# EAGLE schematic board schema (EAGLE 8.1.0)
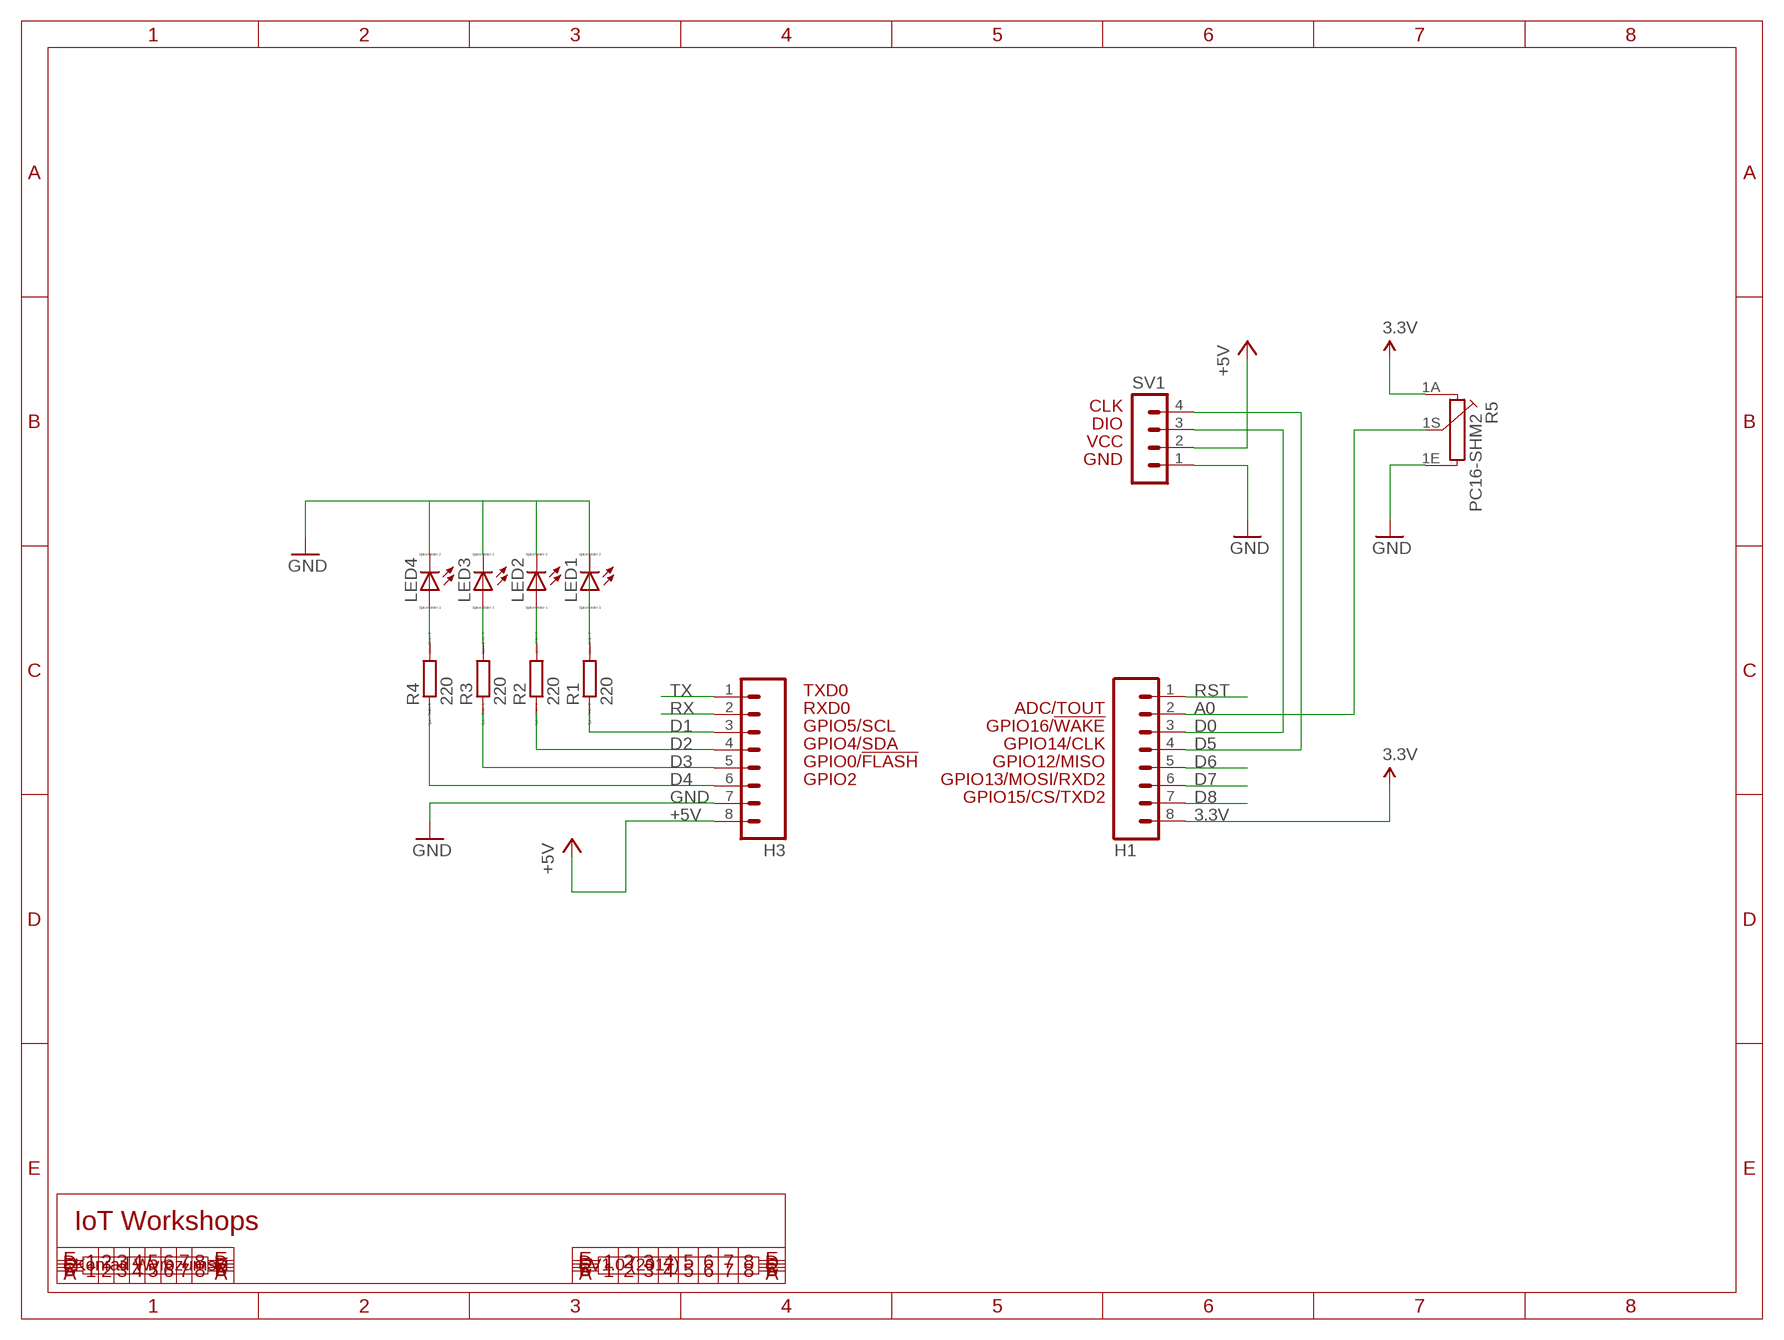
[diagram p0: schematic, sheet 1]

## Parts
H1  M08  [1X08]
H3  M08  [1X08]
LED1  LED_ELD260  [LED_LD260]
LED2  LED_ELD260  [LED_LD260]
LED3  LED_ELD260  [LED_LD260]
LED4  LED_ELD260  [LED_LD260]
R1  220  R0207/10  [0207/10]
R2  220  R0207/10  [0207/10]
R3  220  R0207/10  [0207/10]
R4  220  R0207/10  [0207/10]
R5  PC16-SHM2  [PC16-SHM2]
SV1  MA04-1  [MA04-1]

## Nets
3.3V: H1.8 R5.1A
+5V: H3.8 SV1.2
A0: H1.2 R5.1S
D0: H1.3 SV1.3
D1: H3.3 R1.1
D2: H3.4 R2.1
D3: H3.5 R3.1
D4: H3.6 R4.1
D5: H1.4 SV1.4
D6: H1.5
D7: H1.6
D8: H1.7
GND: H3.7 LED2.K(C) LED3.K(C) LED4.K(C) R5.1E SV1.1
N$1: LED4.A R4.2
N$2: LED3.A R3.2
N$3: LED2.A R2.2
N$4: LED1.A LED1.K(C) R1.2
RST: H1.1
RX: H3.2
TX: H3.1
Unconnected: R5.M1 R5.M2 R5.M3 R5.M4

## Notes on the sheet
- CLK
- DIO
- VCC
- GND
- TXD0
- RXD0 | ADC/TOUT
- GPIO5/SCL | GPIO16/!WAKE
- GPIO4/SDA | GPIO14/CLK
- GPIO0/!FLASH | GPIO12/MISO
- GPIO2 | GPIO13/MOSI/RXD2
- GPIO15/CS/TXD2
- IoT Workshops
- Konrad Wyrozumski | V1.0 (2017)

## Library data of the parts
H1 H3 = freetronics-original:M08: Header 8 Standard 8-pin 0.1" header. Use with straight break away headers (SKU : PRT-00116), right angle break away headers (PRT-00553), swiss pins (PRT-00743), machine pins (PRT-00117), and female headers (PRT-00115).
LED1-LED4 = eagle-ltspice:LED_E: LED Source: http://www.osram.convergy.de Source: www.luxeon.com Source: www.kingbright.com; SPICEMODEL: NONE; SPICEPREFIX: D; SPICETYPE: diode
R1-R4 = eagle-ltspice:R: RESISTOR, European symbol; SPICEMODEL: NONE; SPICEPREFIX: R
R5 = piher:PC16-SHM2: POTENTIOMETER single carbon potentiometer, 16 mm, S3ROH; OC_FARNELL: unknown; OC_NEWARK: unknown
SV1 = con-lstb:MA04-1: PIN HEADER; OC_FARNELL: unknown; OC_NEWARK: unknown

## Net classes
0 default: width 0.203 mm, drill 0.356 mm, clearance 0.152 mm
1 power: width 0.203 mm, clearance 0.152 mm